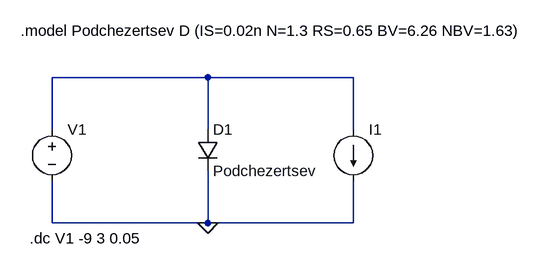
[diagram p0: schematic Draft1.1.asc]
Draft1.1.asc, the LTspice schematic file:
Version 4
SHEET 1 161040 680
WIRE 176 64 -64 64
WIRE 400 64 176 64
WIRE -64 144 -64 64
WIRE 176 144 176 64
WIRE 400 144 400 64
WIRE -64 288 -64 224
WIRE 176 288 176 208
WIRE 176 288 -64 288
WIRE 400 288 400 224
WIRE 400 288 176 288
FLAG 176 288 0
SYMBOL diode 160 144 R0
SYMATTR InstName D1
SYMATTR Value Podchezertsev
SYMBOL voltage -64 128 R0
WINDOW 123 0 0 Left 0
WINDOW 39 0 0 Left 0
SYMATTR InstName V1
SYMATTR Value ""
SYMBOL current 400 144 R0
WINDOW 123 0 0 Left 0
WINDOW 39 0 0 Left 0
WINDOW 3 24 80 Invisible 2
SYMATTR InstName I1
SYMATTR Value TBL(-12.0000000000000000 -7.2422000000000000 -11.9500000000000000 -7.1658000000000000 -11.9000000000000000 -7.0895000000000000 -11.8500000000000000 -7.0131000000000000 -11.8000000000000000 -6.9367000000000000 -11.7500000000000000 -6.8604000000000000 -11.7000000000000000 -6.7841000000000000 -11.6500000000000000 -6.7077000000000000 -11.6000000000000000 -6.6314000000000000 -11.5500000000000000 -6.5551000000000000 -11.5000000000000000 -6.4788000000000000 -11.4500000000000000 -6.4025000000000000 -11.4000000000000000 -6.3262000000000000 -11.3500000000000000 -6.2499000000000000 -11.3000000000000000 -6.1736000000000000 -11.2500000000000000 -6.0973000000000000 -11.2000000000000000 -6.0211000000000000 -11.1500000000000000 -5.9448000000000000 -11.1000000000000000 -5.8685000000000000 -11.0500000000000000 -5.7923000000000000 -11.0000000000000000 -5.7161000000000000 -10.9500000000000000 -5.6399000000000000 -10.9000000000000000 -5.5636000000000000 -10.8500000000000000 -5.4874000000000000 -10.8000000000000000 -5.4112000000000000 -10.7500000000000000 -5.3351000000000000 -10.7000000000000000 -5.2589000000000000 -10.6500000000000000 -5.1827000000000000 -10.6000000000000000 -5.1066000000000000 -10.5500000000000000 -5.0304000000000000 -10.5000000000000000 -4.9543000000000000 -10.4500000000000000 -4.8782000000000000 -10.4000000000000000 -4.8021000000000000 -10.3500000000000000 -4.7260000000000000 -10.3000000000000000 -4.6499000000000000 -10.2500000000000000 -4.5739000000000000 -10.2000000000000000 -4.4978000000000000 -10.1500000000000000 -4.4218000000000000 -10.1000000000000000 -4.3458000000000000 -10.0500000000000000 -4.2698000000000000 -10.0000000000000000 -4.1938000000000000 -9.9500000000000000 -4.1178000000000000 -9.9000000000000000 -4.0419000000000000 -9.8500000000000000 -3.9659000000000000 -9.8000000000000000 -3.8900000000000000 -9.7500000000000000 -3.8141000000000000 -9.7000000000000000 -3.7382000000000000 -9.6500000000000000 -3.6624000000000000 -9.6000000000000000 -3.5866000000000000 -9.5500000000000000 -3.5108000000000000 -9.5000000000000000 -3.4350000000000000 -9.4500000000000000 -3.3592000000000000 -9.4000000000000000 -3.2835000000000000 -9.3500000000000000 -3.2078000000000000 -9.3000000000000000 -3.1321000000000000 -9.2500000000000000 -3.0564000000000000 -9.2000000000000000 -2.9808000000000000 -9.1500000000000000 -2.9053000000000000 -9.1000000000000000 -2.8297000000000000 -9.0500000000000000 -2.7542000000000000 -9.0000000000000000 -2.6787000000000000 -8.9500000000000000 -2.6033000000000000 -8.9000000000000000 -2.5279000000000000 -8.8500000000000000 -2.4526000000000000 -8.8000000000000000 -2.3773000000000000 -8.7500000000000000 -2.3020000000000000 -8.7000000000000000 -2.2268000000000000 -8.6500000000000000 -2.1517000000000000 -8.6000000000000000 -2.0766000000000000 -8.5500000000000000 -2.0016000000000000 -8.5000000000000000 -1.9267000000000000 -8.4500000000000000 -1.8518000000000000 -8.4000000000000000 -1.7771000000000000 -8.3500000000000000 -1.7024000000000000 -8.3000000000000000 -1.6278000000000000 -8.2500000000000000 -1.5533000000000000 -8.2000000000000000 -1.4790000000000000 -8.1500000000000000 -1.4047000000000000 -8.1000000000000000 -1.3306000000000000 -8.0500000000000000 -1.2567000000000000 -8.0000000000000000 -1.1829000000000000 -7.9500000000000000 -1.1094000000000000 -7.9000000000000000 -1.0360000000000000 -7.8500000000000000 -0.9629018000000000 -7.8000000000000000 -0.8900838000000000 -7.7500000000000000 -0.8175952000000000 -7.7000000000000000 -0.7454917000000000 -7.6500000000000000 -0.6738434000000000 -7.6000000000000000 -0.6027413000000000 -7.5500000000000000 -0.5323052000000000 -7.5000000000000000 -0.4626975000000000 -7.4500000000000000 -0.3941471000000000 -7.4000000000000000 -0.3269774000000000 -7.3500000000000000 -0.2616830000000000 -7.3000000000000000 -0.1990434000000000 -7.2500000000000000 -0.1403569000000000 -7.2000000000000000 -0.0878777000000000 -7.1500000000000000 -0.0454147000000000 -7.1000000000000000 -0.0176954000000000 -7.0500000000000000 -0.0051552000000000 -7.0000000000000000 -0.0012723000000000 -6.9500000000000000 -0.0002970142000000 -6.9000000000000000 -0.0000683499000000 -6.8500000000000000 -0.0000156760000000 -6.8000000000000000 -0.0000035925000000 -6.7500000000000000 -0.0000008231506000 -6.7000000000000000 -0.0000001886058000 -6.6500000000000000 -0.0000000432182000 -6.6000000000000000 -0.0000000099071000 -6.5500000000000000 -0.0000000022749000 -6.5000000000000000 -0.0000000005262280 -6.4500000000000000 -0.0000000001255280 -6.4000000000000000 -0.0000000000336833 -6.3500000000000000 -0.0000000000302656 -6.3000000000000000 -0.0000000000302158 -6.2500000000000000 -0.0000000000301661 -6.2000000000000000 -0.0000000000301146 -6.1500000000000000 -0.0000000000300648 -6.1000000000000000 -0.0000000000300151 -6.0500000000000000 -0.0000000000299654 -6.0000000000000000 -0.0000000000299156 -5.9500000000000000 -0.0000000000298659 -5.9000000000000000 -0.0000000000298161 -5.8500000000000000 -0.0000000000297646 -5.8000000000000000 -0.0000000000297149 -5.7500000000000000 -0.0000000000296652 -5.7000000000000000 -0.0000000000296154 -5.6500000000000000 -0.0000000000295657 -5.6000000000000000 -0.0000000000295159 -5.5500000000000000 -0.0000000000294662 -5.5000000000000000 -0.0000000000294147 -5.4500000000000000 -0.0000000000293650 -5.4000000000000000 -0.0000000000293152 -5.3500000000000000 -0.0000000000292655 -5.3000000000000000 -0.0000000000292157 -5.2500000000000000 -0.0000000000291660 -5.2000000000000000 -0.0000000000291154 -5.1500000000000000 -0.0000000000290656 -5.1000000000000000 -0.0000000000290150 -5.0500000000000000 -0.0000000000289653 -5.0000000000000000 -0.0000000000289155 -4.9500000000000000 -0.0000000000288658 -4.9000000000000000 -0.0000000000288152 -4.8500000000000000 -0.0000000000287654 -4.8000000000000000 -0.0000000000287157 -4.7500000000000000 -0.0000000000286651 -4.7000000000000000 -0.0000000000286153 -4.6500000000000000 -0.0000000000285656 -4.6000000000000000 -0.0000000000285150 -4.5500000000000000 -0.0000000000284652 -4.5000000000000000 -0.0000000000284155 -4.4500000000000000 -0.0000000000283658 -4.4000000000000000 -0.0000000000283151 -4.3500000000000000 -0.0000000000282654 -4.3000000000000000 -0.0000000000282157 -4.2500000000000000 -0.0000000000281650 -4.2000000000000000 -0.0000000000281153 -4.1500000000000000 -0.0000000000280655 -4.1000000000000000 -0.0000000000280149 -4.0500000000000000 -0.0000000000279652 -4.0000000000000000 -0.0000000000279154 -3.9500000000000000 -0.0000000000278657 -3.9000000000000000 -0.0000000000278151 -3.8500000000000000 -0.0000000000277653 -3.8000000000000000 -0.0000000000277156 -3.7500000000000000 -0.0000000000276650 -3.7000000000000000 -0.0000000000276152 -3.6500000000000000 -0.0000000000275655 -3.6000000000000000 -0.0000000000275149 -3.5500000000000000 -0.0000000000274651 -3.5000000000000000 -0.0000000000274154 -3.4500000000000000 -0.0000000000273657 -3.4000000000000000 -0.0000000000273150 -3.3500000000000000 -0.0000000000272653 -3.3000000000000000 -0.0000000000272156 -3.2500000000000000 -0.0000000000271649 -3.2000000000000000 -0.0000000000271152 -3.1500000000000000 -0.0000000000270655 -3.1000000000000000 -0.0000000000270148 -3.0500000000000000 -0.0000000000269651 -3.0000000000000000 -0.0000000000269154 -2.9500000000000000 -0.0000000000268656 -2.9000000000000000 -0.0000000000268150 -2.8500000000000000 -0.0000000000267653 -2.8000000000000000 -0.0000000000267155 -2.7500000000000000 -0.0000000000266649 -2.7000000000000000 -0.0000000000266152 -2.6500000000000000 -0.0000000000265654 -2.6000000000000000 -0.0000000000265157 -2.5500000000000000 -0.0000000000264655 -2.5000000000000000 -0.0000000000264158 -2.4500000000000000 -0.0000000000263656 -2.4000000000000000 -0.0000000000263158 -2.3500000000000000 -0.0000000000262657 -2.3000000000000000 -0.0000000000262155 -2.2500000000000000 -0.0000000000261657 -2.2000000000000000 -0.0000000000261156 -2.1500000000000000 -0.0000000000260658 -2.1000000000000000 -0.0000000000260156 -2.0500000000000000 -0.0000000000259655 -2.0000000000000000 -0.0000000000259157 -1.9500000000000000 -0.0000000000258655 -1.9000000000000000 -0.0000000000258158 -1.8500000000000000 -0.0000000000257656 -1.8000000000000000 -0.0000000000257154 -1.7500000000000000 -0.0000000000256657 -1.7000000000000000 -0.0000000000256155 -1.6500000000000000 -0.0000000000255658 -1.6000000000000000 -0.0000000000255156 -1.5500000000000000 -0.0000000000254654 -1.5000000000000000 -0.0000000000254157 -1.4500000000000000 -0.0000000000253655 -1.4000000000000000 -0.0000000000253157 -1.3500000000000000 -0.0000000000252656 -1.3000000000000000 -0.0000000000252154 -1.2500000000000000 -0.0000000000251654 -1.2000000000000000 -0.0000000000251155 -1.1500000000000000 -0.0000000000250653 -1.1000000000000000 -0.0000000000250153 -1.0500000000000000 -0.0000000000249654 -1.0000000000000000 -0.0000000000249154 -0.9500000000000000 -0.0000000000248654 -0.9000000000000000 -0.0000000000248153 -0.8500000000000000 -0.0000000000247653 -0.8000000000000000 -0.0000000000247153 -0.7500000000000000 -0.0000000000246654 -0.7000000000000000 -0.0000000000246154 -0.6500000000000000 -0.0000000000245653 -0.6000000000000000 -0.0000000000245154 -0.5500000000000000 -0.0000000000244653 -0.5000000000000000 -0.0000000000244154 -0.4500000000000000 -0.0000000000243653 -0.4000000000000000 -0.0000000000243153 -0.3500000000000000 -0.0000000000242654 -0.3000000000000000 -0.0000000000242120 -0.2500000000000000 -0.0000000000241503 -0.2000000000000000 -0.0000000000240495 -0.1500000000000000 -0.0000000000237777 -0.1000000000000000 -0.0000000000227599 -0.0500000000000000 -0.0000000000184859 0.0000000000000000 0.0000000000000000 0.0500000000000000 0.0000000000805149 0.1000000000000000 0.0000000004317595 0.1500000000000000 0.0000000019646000 0.2000000000000000 0.0000000086547000 0.2500000000000000 0.0000000378540000 0.3000000000000000 0.0000001652958000 0.3500000000000000 0.0000007215168000 0.4000000000000000 0.0000031490000000 0.4500000000000000 0.0000137415000000 0.5000000000000000 0.0000599228000000 0.5500000000000000 0.0002605341000000 0.6000000000000000 0.0011186000000000 0.6500000000000000 0.0045698000000000 0.7000000000000000 0.0160177000000000 0.7500000000000000 0.0422760000000000 0.8000000000000000 0.0836028000000000 0.8500000000000000 0.1353684000000000 0.9000000000000000 0.1936106000000000 0.9500000000000000 0.2559599000000000 1.0000000000000000 0.3210542000000000 1.0500000000000000 0.3880794000000000 1.1000000000000000 0.4565231000000000 1.1500000000000000 0.5260463000000000 1.2000000000000000 0.5964140000000000 1.2500000000000000 0.6674622000000000 1.3000000000000000 0.7390658000000000 1.3500000000000000 0.8111319000000000 1.4000000000000000 0.8835885000000000 1.4500000000000000 0.9563790000000000 1.5000000000000000 1.0295000000000000 1.5500000000000000 1.1028000000000000 1.6000000000000000 1.1763000000000000 1.6500000000000000 1.2501000000000000 1.7000000000000000 1.3240000000000000 1.7500000000000000 1.3981000000000000 1.8000000000000000 1.4723000000000000 1.8500000000000000 1.5467000000000000 1.9000000000000000 1.6211000000000000 1.9500000000000000 1.6957000000000000 2.0000000000000000 1.7704000000000000 2.0500000000000000 1.8451000000000000 2.1000000000000000 1.9200000000000000 2.1500000000000000 1.9949000000000000 2.2000000000000000 2.0699000000000000 2.2500000000000000 2.1450000000000000 2.3000000000000000 2.2201000000000000 2.3500000000000000 2.2953000000000000 2.4000000000000000 2.3705000000000000 2.4500000000000000 2.4458000000000000 2.5000000000000000 2.5212000000000000 2.5500000000000000 2.5965000000000000 2.6000000000000000 2.6720000000000000 2.6500000000000000 2.7474000000000000 2.7000000000000000 2.8230000000000000)
TEXT -98 312 Left 2 !.dc V1 -9 3 0.05
TEXT -112 -8 Left 2 !.model Podchezertsev D (IS=0.02n N=1.3 RS=0.65 BV=6.26 NBV=1.63)

The netlist it stands for:
* Draft1.1.asc
D1 N001 0 Podchezertsev
V1 N001 0
I1 N001 0 TBL(-12.0000000000000000 -7.2422000000000000 -11.9500000000000000 -7.1658000000000000 -11.9000000000000000 -7.0895000000000000 -11.8500000000000000 -7.0131000000000000 -11.8000000000000000 -6.9367000000000000 -11.7500000000000000 -6.8604000000000000 -11.7000000000000000 -6.7841000000000000 -11.6500000000000000 -6.7077000000000000 -11.6000000000000000 -6.6314000000000000 -11.5500000000000000 -6.5551000000000000 -11.5000000000000000 -6.4788000000000000 -11.4500000000000000 -6.4025000000000000 -11.4000000000000000 -6.3262000000000000 -11.3500000000000000 -6.2499000000000000 -11.3000000000000000 -6.1736000000000000 -11.2500000000000000 -6.0973000000000000 -11.2000000000000000 -6.0211000000000000 -11.1500000000000000 -5.9448000000000000 -11.1000000000000000 -5.8685000000000000 -11.0500000000000000 -5.7923000000000000 -11.0000000000000000 -5.7161000000000000 -10.9500000000000000 -5.6399000000000000 -10.9000000000000000 -5.5636000000000000 -10.8500000000000000 -5.4874000000000000 -10.8000000000000000 -5.4112000000000000 -10.7500000000000000 -5.3351000000000000 -10.7000000000000000 -5.2589000000000000 -10.6500000000000000 -5.1827000000000000 -10.6000000000000000 -5.1066000000000000 -10.5500000000000000 -5.0304000000000000 -10.5000000000000000 -4.9543000000000000 -10.4500000000000000 -4.8782000000000000 -10.4000000000000000 -4.8021000000000000 -10.3500000000000000 -4.7260000000000000 -10.3000000000000000 -4.6499000000000000 -10.2500000000000000 -4.5739000000000000 -10.2000000000000000 -4.4978000000000000 -10.1500000000000000 -4.4218000000000000 -10.1000000000000000 -4.3458000000000000 -10.0500000000000000 -4.2698000000000000 -10.0000000000000000 -4.1938000000000000 -9.9500000000000000 -4.1178000000000000 -9.9000000000000000 -4.0419000000000000 -9.8500000000000000 -3.9659000000000000 -9.8000000000000000 -3.8900000000000000 -9.7500000000000000 -3.8141000000000000 -9.7000000000000000 -3.7382000000000000 -9.6500000000000000 -3.6624000000000000 -9.6000000000000000 -3.5866000000000000 -9.5500000000000000 -3.5108000000000000 -9.5000000000000000 -3.4350000000000000 -9.4500000000000000 -3.3592000000000000 -9.4000000000000000 -3.2835000000000000 -9.3500000000000000 -3.2078000000000000 -9.3000000000000000 -3.1321000000000000 -9.2500000000000000 -3.0564000000000000 -9.2000000000000000 -2.9808000000000000 -9.1500000000000000 -2.9053000000000000 -9.1000000000000000 -2.8297000000000000 -9.0500000000000000 -2.7542000000000000 -9.0000000000000000 -2.6787000000000000 -8.9500000000000000 -2.6033000000000000 -8.9000000000000000 -2.5279000000000000 -8.8500000000000000 -2.4526000000000000 -8.8000000000000000 -2.3773000000000000 -8.7500000000000000 -2.3020000000000000 -8.7000000000000000 -2.2268000000000000 -8.6500000000000000 -2.1517000000000000 -8.6000000000000000 -2.0766000000000000 -8.5500000000000000 -2.0016000000000000 -8.5000000000000000 -1.9267000000000000 -8.4500000000000000 -1.8518000000000000 -8.4000000000000000 -1.7771000000000000 -8.3500000000000000 -1.7024000000000000 -8.3000000000000000 -1.6278000000000000 -8.2500000000000000 -1.5533000000000000 -8.2000000000000000 -1.4790000000000000 -8.1500000000000000 -1.4047000000000000 -8.1000000000000000 -1.3306000000000000 -8.0500000000000000 -1.2567000000000000 -8.0000000000000000 -1.1829000000000000 -7.9500000000000000 -1.1094000000000000 -7.9000000000000000 -1.0360000000000000 -7.8500000000000000 -0.9629018000000000 -7.8000000000000000 -0.8900838000000000 -7.7500000000000000 -0.8175952000000000 -7.7000000000000000 -0.7454917000000000 -7.6500000000000000 -0.6738434000000000 -7.6000000000000000 -0.6027413000000000 -7.5500000000000000 -0.5323052000000000 -7.5000000000000000 -0.4626975000000000 -7.4500000000000000 -0.3941471000000000 -7.4000000000000000 -0.3269774000000000 -7.3500000000000000 -0.2616830000000000 -7.3000000000000000 -0.1990434000000000 -7.2500000000000000 -0.1403569000000000 -7.2000000000000000 -0.0878777000000000 -7.1500000000000000 -0.0454147000000000 -7.1000000000000000 -0.0176954000000000 -7.0500000000000000 -0.0051552000000000 -7.0000000000000000 -0.0012723000000000 -6.9500000000000000 -0.0002970142000000 -6.9000000000000000 -0.0000683499000000 -6.8500000000000000 -0.0000156760000000 -6.8000000000000000 -0.0000035925000000 -6.7500000000000000 -0.0000008231506000 -6.7000000000000000 -0.0000001886058000 -6.6500000000000000 -0.0000000432182000 -6.6000000000000000 -0.0000000099071000 -6.5500000000000000 -0.0000000022749000 -6.5000000000000000 -0.0000000005262280 -6.4500000000000000 -0.0000000001255280 -6.4000000000000000 -0.0000000000336833 -6.3500000000000000 -0.0000000000302656 -6.3000000000000000 -0.0000000000302158 -6.2500000000000000 -0.0000000000301661 -6.2000000000000000 -0.0000000000301146 -6.1500000000000000 -0.0000000000300648 -6.1000000000000000 -0.0000000000300151 -6.0500000000000000 -0.0000000000299654 -6.0000000000000000 -0.0000000000299156 -5.9500000000000000 -0.0000000000298659 -5.9000000000000000 -0.0000000000298161 -5.8500000000000000 -0.0000000000297646 -5.8000000000000000 -0.0000000000297149 -5.7500000000000000 -0.0000000000296652 -5.7000000000000000 -0.0000000000296154 -5.6500000000000000 -0.0000000000295657 -5.6000000000000000 -0.0000000000295159 -5.5500000000000000 -0.0000000000294662 -5.5000000000000000 -0.0000000000294147 -5.4500000000000000 -0.0000000000293650 -5.4000000000000000 -0.0000000000293152 -5.3500000000000000 -0.0000000000292655 -5.3000000000000000 -0.0000000000292157 -5.2500000000000000 -0.0000000000291660 -5.2000000000000000 -0.0000000000291154 -5.1500000000000000 -0.0000000000290656 -5.1000000000000000 -0.0000000000290150 -5.0500000000000000 -0.0000000000289653 -5.0000000000000000 -0.0000000000289155 -4.9500000000000000 -0.0000000000288658 -4.9000000000000000 -0.0000000000288152 -4.8500000000000000 -0.0000000000287654 -4.8000000000000000 -0.0000000000287157 -4.7500000000000000 -0.0000000000286651 -4.7000000000000000 -0.0000000000286153 -4.6500000000000000 -0.0000000000285656 -4.6000000000000000 -0.0000000000285150 -4.5500000000000000 -0.0000000000284652 -4.5000000000000000 -0.0000000000284155 -4.4500000000000000 -0.0000000000283658 -4.4000000000000000 -0.0000000000283151 -4.3500000000000000 -0.0000000000282654 -4.3000000000000000 -0.0000000000282157 -4.2500000000000000 -0.0000000000281650 -4.2000000000000000 -0.0000000000281153 -4.1500000000000000 -0.0000000000280655 -4.1000000000000000 -0.0000000000280149 -4.0500000000000000 -0.0000000000279652 -4.0000000000000000 -0.0000000000279154 -3.9500000000000000 -0.0000000000278657 -3.9000000000000000 -0.0000000000278151 -3.8500000000000000 -0.0000000000277653 -3.8000000000000000 -0.0000000000277156 -3.7500000000000000 -0.0000000000276650 -3.7000000000000000 -0.0000000000276152 -3.6500000000000000 -0.0000000000275655 -3.6000000000000000 -0.0000000000275149 -3.5500000000000000 -0.0000000000274651 -3.5000000000000000 -0.0000000000274154 -3.4500000000000000 -0.0000000000273657 -3.4000000000000000 -0.0000000000273150 -3.3500000000000000 -0.0000000000272653 -3.3000000000000000 -0.0000000000272156 -3.2500000000000000 -0.0000000000271649 -3.2000000000000000 -0.0000000000271152 -3.1500000000000000 -0.0000000000270655 -3.1000000000000000 -0.0000000000270148 -3.0500000000000000 -0.0000000000269651 -3.0000000000000000 -0.0000000000269154 -2.9500000000000000 -0.0000000000268656 -2.9000000000000000 -0.0000000000268150 -2.8500000000000000 -0.0000000000267653 -2.8000000000000000 -0.0000000000267155 -2.7500000000000000 -0.0000000000266649 -2.7000000000000000 -0.0000000000266152 -2.6500000000000000 -0.0000000000265654 -2.6000000000000000 -0.0000000000265157 -2.5500000000000000 -0.0000000000264655 -2.5000000000000000 -0.0000000000264158 -2.4500000000000000 -0.0000000000263656 -2.4000000000000000 -0.0000000000263158 -2.3500000000000000 -0.0000000000262657 -2.3000000000000000 -0.0000000000262155 -2.2500000000000000 -0.0000000000261657 -2.2000000000000000 -0.0000000000261156 -2.1500000000000000 -0.0000000000260658 -2.1000000000000000 -0.0000000000260156 -2.0500000000000000 -0.0000000000259655 -2.0000000000000000 -0.0000000000259157 -1.9500000000000000 -0.0000000000258655 -1.9000000000000000 -0.0000000000258158 -1.8500000000000000 -0.0000000000257656 -1.8000000000000000 -0.0000000000257154 -1.7500000000000000 -0.0000000000256657 -1.7000000000000000 -0.0000000000256155 -1.6500000000000000 -0.0000000000255658 -1.6000000000000000 -0.0000000000255156 -1.5500000000000000 -0.0000000000254654 -1.5000000000000000 -0.0000000000254157 -1.4500000000000000 -0.0000000000253655 -1.4000000000000000 -0.0000000000253157 -1.3500000000000000 -0.0000000000252656 -1.3000000000000000 -0.0000000000252154 -1.2500000000000000 -0.0000000000251654 -1.2000000000000000 -0.0000000000251155 -1.1500000000000000 -0.0000000000250653 -1.1000000000000000 -0.0000000000250153 -1.0500000000000000 -0.0000000000249654 -1.0000000000000000 -0.0000000000249154 -0.9500000000000000 -0.0000000000248654 -0.9000000000000000 -0.0000000000248153 -0.8500000000000000 -0.0000000000247653 -0.8000000000000000 -0.0000000000247153 -0.7500000000000000 -0.0000000000246654 -0.7000000000000000 -0.0000000000246154 -0.6500000000000000 -0.0000000000245653 -0.6000000000000000 -0.0000000000245154 -0.5500000000000000 -0.0000000000244653 -0.5000000000000000 -0.0000000000244154 -0.4500000000000000 -0.0000000000243653 -0.4000000000000000 -0.0000000000243153 -0.3500000000000000 -0.0000000000242654 -0.3000000000000000 -0.0000000000242120 -0.2500000000000000 -0.0000000000241503 -0.2000000000000000 -0.0000000000240495 -0.1500000000000000 -0.0000000000237777 -0.1000000000000000 -0.0000000000227599 -0.0500000000000000 -0.0000000000184859 0.0000000000000000 0.0000000000000000 0.0500000000000000 0.0000000000805149 0.1000000000000000 0.0000000004317595 0.1500000000000000 0.0000000019646000 0.2000000000000000 0.0000000086547000 0.2500000000000000 0.0000000378540000 0.3000000000000000 0.0000001652958000 0.3500000000000000 0.0000007215168000 0.4000000000000000 0.0000031490000000 0.4500000000000000 0.0000137415000000 0.5000000000000000 0.0000599228000000 0.5500000000000000 0.0002605341000000 0.6000000000000000 0.0011186000000000 0.6500000000000000 0.0045698000000000 0.7000000000000000 0.0160177000000000 0.7500000000000000 0.0422760000000000 0.8000000000000000 0.0836028000000000 0.8500000000000000 0.1353684000000000 0.9000000000000000 0.1936106000000000 0.9500000000000000 0.2559599000000000 1.0000000000000000 0.3210542000000000 1.0500000000000000 0.3880794000000000 1.1000000000000000 0.4565231000000000 1.1500000000000000 0.5260463000000000 1.2000000000000000 0.5964140000000000 1.2500000000000000 0.6674622000000000 1.3000000000000000 0.7390658000000000 1.3500000000000000 0.8111319000000000 1.4000000000000000 0.8835885000000000 1.4500000000000000 0.9563790000000000 1.5000000000000000 1.0295000000000000 1.5500000000000000 1.1028000000000000 1.6000000000000000 1.1763000000000000 1.6500000000000000 1.2501000000000000 1.7000000000000000 1.3240000000000000 1.7500000000000000 1.3981000000000000 1.8000000000000000 1.4723000000000000 1.8500000000000000 1.5467000000000000 1.9000000000000000 1.6211000000000000 1.9500000000000000 1.6957000000000000 2.0000000000000000 1.7704000000000000 2.0500000000000000 1.8451000000000000 2.1000000000000000 1.9200000000000000 2.1500000000000000 1.9949000000000000 2.2000000000000000 2.0699000000000000 2.2500000000000000 2.1450000000000000 2.3000000000000000 2.2201000000000000 2.3500000000000000 2.2953000000000000 2.4000000000000000 2.3705000000000000 2.4500000000000000 2.4458000000000000 2.5000000000000000 2.5212000000000000 2.5500000000000000 2.5965000000000000 2.6000000000000000 2.6720000000000000 2.6500000000000000 2.7474000000000000 2.7000000000000000 2.8230000000000000)
.model D D
.lib standard.dio
.dc V1 -9 3 0.05
.model Podchezertsev D (IS=0.02n N=1.3 RS=0.65 BV=6.26 NBV=1.63)
.backanno
.end